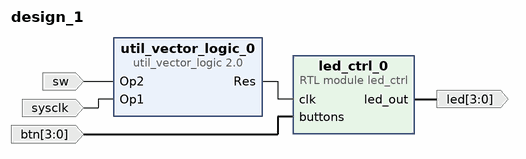
[diagram p0: block diagram of the top level]
# Vivado block design design_1, xc7z020clg400-1, Vivado 2024.2
create_bd_design design_1

create_bd_port -dir I sw
create_bd_port -dir I sysclk
create_bd_port -dir I -from 3 -to 0 btn
create_bd_port -dir O -from 3 -to 0 led

create_bd_cell -type module -reference led_ctrl led_ctrl_0
create_bd_cell -type ip -vlnv xilinx.com:ip:util_vector_logic:2.0 util_vector_logic_0
set_property -dict {CONFIG.C_SIZE 1} [get_bd_cells util_vector_logic_0]

# ---- connections ----

connect_bd_net [get_bd_ports btn] [get_bd_pins led_ctrl_0/buttons]
connect_bd_net [get_bd_pins led_ctrl_0/led_out] [get_bd_ports led]
connect_bd_net [get_bd_ports sw] [get_bd_pins util_vector_logic_0/Op2]
connect_bd_net [get_bd_ports sysclk] [get_bd_pins util_vector_logic_0/Op1]
connect_bd_net [get_bd_pins util_vector_logic_0/Res] [get_bd_pins led_ctrl_0/clk]

validate_bd_design
save_bd_design
